# Altium schematic sheet Serial to USB Converter.SchDoc: UART0 Serial to USB Converter
size 393 x 281 mm; SheetNumber: 43; SheetTotal: 44
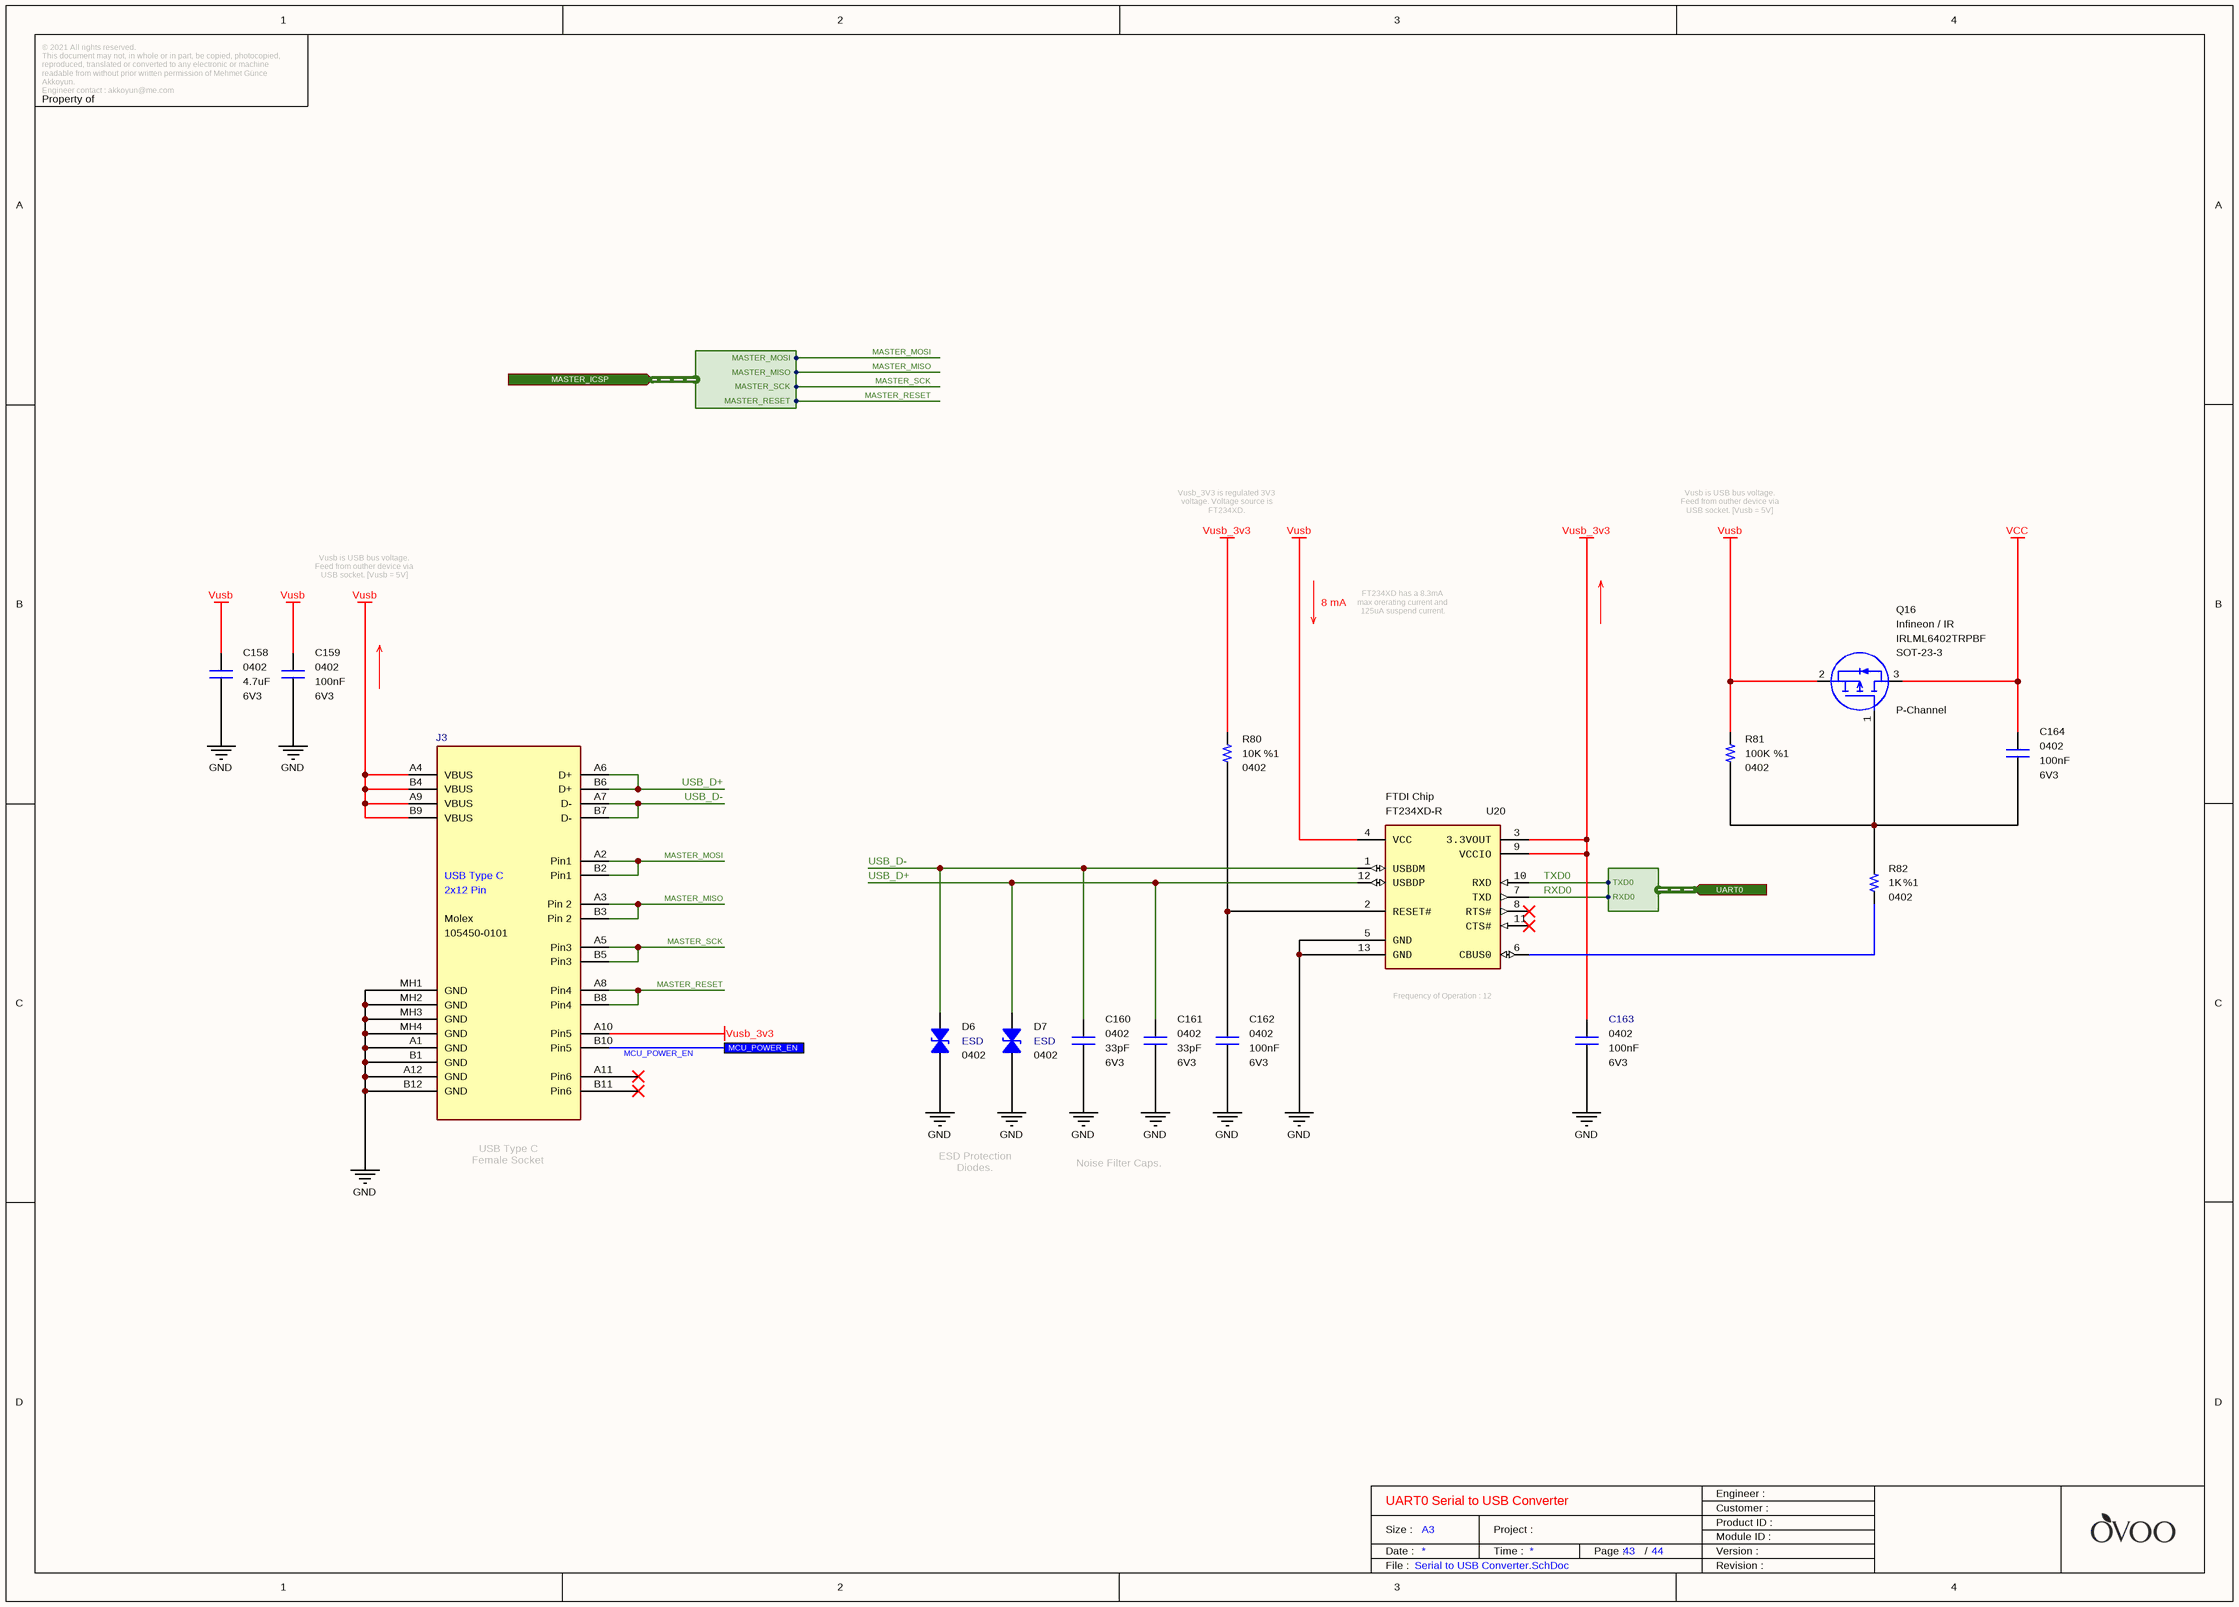
[diagram p0: Serial to USB Converter.SchDoc]

## Parts
C158  value 4.7uF  Case: 0402  Voltage: 6V3  [CAPACITOR_0402]  (hidden comment: Multilayer Ceramic Capacitor)
C159  value 100nF  Case: 0402  Voltage: 6V3  [CAPACITOR_0402]  (hidden comment: Multilayer Ceramic Capacitor)
C160  value 33pF  Case: 0402  Voltage: 6V3  [CAPACITOR_0402]  (hidden comment: Multilayer Ceramic Capacitor)
C161  value 33pF  Case: 0402  Voltage: 6V3  [CAPACITOR_0402]  (hidden comment: Multilayer Ceramic Capacitor)
C162  value 100nF  Case: 0402  Voltage: 6V3  [CAPACITOR_0402]  (hidden comment: Multilayer Ceramic Capacitor)
C163  value 100nF  Case: 0402  Voltage: 6V3  [CAPACITOR_0402]  (hidden comment: Multilayer Ceramic Capacitor)
C164  value 100nF  Case: 0402  Voltage: 6V3  [CAPACITOR_0402]  (hidden comment: Multilayer Ceramic Capacitor)
D6  Case: 0402  [ESD_0402]  (hidden comment: ESD Suppressors)
D7  Case: 0402  [ESD_0402]  (hidden comment: ESD Suppressors)
J3  Manufacturer Part Number: 105450-0101  Manufacturer Name: Molex  [USB Type C - Molex 105450-0101]  (hidden comment: USB Type C SMD Connector)
Q16  Transistor Polarity: P-Channel  Manufacturer Part Number: IRLML6402TRPBF  Manufacturer Name: Infineon / IR  [SOT-23-3]  (hidden comment: P-Channel MosFET)
R80  value 10K  Tolerance: %1  Case: 0402  [RESISTOR_0402]  (hidden comment: Thick Film Resistor)
R81  value 100K  Tolerance: %1  Case: 0402  [RESISTOR_0402]  (hidden comment: Thick Film Resistor)
R82  value 1K  Tolerance: %1  Case: 0402  [RESISTOR_0402]  (hidden comment: Thick Film Resistor)
U20  Manufacturer Part Number: FT234XD-R  Manufacturer Name: FTDI Chip  [DFN-12]  (hidden comment: USB/UART IC)

## Ports
MASTER_ICSP (in, harness MASTER_ICSP), MCU_POWER_EN, UART0 (in, harness UART0)

## Harnesses
UART0: RXD0, TXD0
MASTER_ICSP: MASTER_MOSI, MASTER_MISO, MASTER_SCK, MASTER_RESET

## Nets
GND: C158.1 C159.1 C160.2 C161.2 C162.2 C163.2 D6.1 D7.1 J3.A1(GND) J3.A12(GND) J3.B1(GND) J3.B12(GND) J3.MH1(GND) J3.MH2(GND) J3.MH3(GND) J3.MH4(GND) U20.5(GND) U20.13(GND)
VCC: C164.2 Q16.3(D)
Vusb: C158.2 C159.2 J3.A4(VBUS) J3.A9(VBUS) J3.B4(VBUS) J3.B9(VBUS) Q16.2(S) R81.2 U20.4(VCC)
Vusb_3v3: C163.1 J3.A10(Pin5) R80.2 U20.3(3.3VOUT) U20.9(VCCIO)
MASTER_MISO: J3.A3(Pin_2) J3.B3(Pin_2) ; port MASTER_ICSP.MASTER_MISO
MASTER_MOSI: J3.A2(Pin1) J3.B2(Pin1) ; port MASTER_ICSP.MASTER_MOSI
MASTER_RESET: J3.A8(Pin4) J3.B8(Pin4) ; port MASTER_ICSP.MASTER_RESET
MASTER_SCK: J3.A5(Pin3) J3.B5(Pin3) ; port MASTER_ICSP.MASTER_SCK
MCU_POWER_EN: J3.B10(Pin5) ; port MCU_POWER_EN
RXD0: U20.7(TXD) ; port UART0.RXD0
TXD0: U20.10(RXD) ; port UART0.TXD0
USB_D+: C161.1 D7.2 J3.A6(D+) J3.B6(D+) U20.12(USBDP)
USB_D-: C160.1 D6.2 J3.A7(D-) J3.B7(D-) U20.1(USBDM)
NetC162_1: C162.1 R80.1 U20.2(RESET#)
NetC164_1: C164.1 Q16.1(G) R81.1 R82.2
NetR82_1: R82.1 U20.6(CBUS0)

Not connected (* = marked no-connect by the designer): J3 A11(Pin6)* B11(Pin6)*; U20 8(RTS#)* 11(CTS#)*

## Notes on the sheet
- Vusb_3V3 is regulated 3V3 voltage. Voltage source is FT234XD.
- Vusb is USB bus voltage. Feed from outher device via USB socket. [Vusb = 5V]
- 8 mA
- FT234XD has a 8.3mA max orerating current and 125uA suspend current.
- (near U20) Frequency of Operation : 12 MHz
- (near J3) USB Type C
  Female Socket
- ESD Protection Diodes.
- Noise Filter Caps.
- © 2021 All rights reserved.
  This document may not, in whole or in part, be copied, photocopied, reproduced, translated or converted to any electronic or machine readable from without prior written permission of Mehmet Günce Akkoyun.
  Engineer contact : akkoyun@me.com
- Property of
- Engineer :
- Date :
- Size :
- A3
- Time :
- Project :
- Page :
- /
- Customer :
- Product ID :
- Module ID :
- Version :
- File :
- Revision :
- (in symbol Connector - USB Type C) USB Type C; 2x12 Pin
- (in symbol Diode - ESD Protection) ESD

## Library data of the parts
C158 = Capacitor - 4.7uF [0402-6V3]: Capacitor - 4.7uF [0402] (Ceramic); Manufacturer Name: Kemet; Manufacturer Part Number: C0402C475M9PACTU; Dielectric: X5R; Tolerance: %20; Height: 0.5mm; ComponentLink1Description: Mouser; ComponentLink1URL: https://www.mouser.com.tr/ProductDetail/KEMET/C0402C475M9PACTU?qs=x4XeXhDQKnr0GX0Xu9DUoQ==; ComponentLink2Description: DataSheet; ComponentLink2URL: https://www.mouser.com.tr/datasheet/2/40/cx5r-776519.pdf; ROHS: Yes; Maximum Operating Temperature: +85; Minimum Operating Temperature: -55; Supplier 1: Mouser; Supplier 2: Arrow; Supplier 3: Farnell; Supplier 4: Digi-Key; Supplier Part Number 1: 80-C0402C475M9P; Supplier Part Number 2: C0402C475M9PACTU; Supplier Part Number 3: 2750760; Supplier Part Number 4: 399-13068-1-ND; Mouser Part Number: 80-C0402C475M9P
C159 C162-C164 = Capacitor - 100nF [0402-6V3]: Capacitor - 100nF [0402-6V3] (Ceramic); Manufacturer Name: AVX; Manufacturer Part Number: 04026D104KAT4A; Dielectric: X5R; Tolerance: %10; Height: 0.25mm; ComponentLink1Description: Mouser; ComponentLink1URL: https://www.mouser.com.tr/ProductDetail/AVX/04026D104KAT4A?qs=sGAEpiMZZMs0AnBnWHyRQPg4iYkCw7IMED%2F4kpqgf7w%3D; ComponentLink2Description: DataSheet; ComponentLink2URL: https://www.mouser.com.tr/datasheet/2/40/cx5r-776519.pdf; ROHS: Yes; Maximum Operating Temperature: +85; Minimum Operating Temperature: -55; Supplier 1: Avnet; Supplier Part Number 1: 04026D104KAT4A; Mouser Part Number: 581-04026D104KAT4A
C160 C161 = Capacitor - 33pF [0402-6V3]: Capacitor - 33pF [0402] (Ceramic); Manufacturer Name: Kemet; Manufacturer Part Number: C0402C330J9RACAUTO; Dielectric: X7R; Tolerance: 10%; Height: 0.5mm; Maximum Operating Temperature: +125; Minimum Operating Temperature: -55; ROHS: Yes; ComponentLink1Description: DataSheet; ComponentLink1URL: https://api.kemet.com/component-edge/download/datasheet/C0402C330J9RACAUTO.pdf; ComponentLink2Description: Mouser; ComponentLink2URL: https://www.mouser.com/Search/Refine.aspx?Keyword=80-C0402C330J9RAUTO; Supplier 1: Mouser; Supplier Part Number 1: 80-C0402C330J9RAUTO; Mouser Part Number: 80-C0402C330J9RAUTO
D6 D7 = Diode - ESD Protection: TVS Diode (Bi-directional); Manufacturer Part Number: 0402ESDA-MLP1; Manufacturer Name: Bussmann / Eaton; Clamping Voltage: 35V; Diode Capacitance: 0.05pF; Polarity: Bidirectional; Voltage ESD Air Gap: 15kV; Voltage ESD Contact: 8kV; Working Voltage: 30V; Height: 0.436mm; Maximum Operating Temperature: +125; Minimum Operating Temperature: -55; ROHS: Yes; ComponentLink1Description: DataSheet; ComponentLink1URL: https://www.mouser.com.tr/datasheet/2/87/47c59e11-d058-4882-bc35-d8572f2ca054-38826.pdf; ComponentLink2Description: Mouser; ComponentLink2URL: https://www.mouser.com.tr/ProductDetail/Bussmann-Eaton/0402ESDA-MLP1?qs=%2Fha2pyFadughxyc7TyLWeW%2FUvipVY6Ex3naV%2FjpO3plZBZWDLqV4bw%3D%3D; Supplier 1: Mouser; Supplier 2: Digi-Key; Supplier Part Number 2: 283-2964-1-ND; Supplier Part Number 1: 504-0402ESDA-MLP1; Mouser Part Number: 504-0402ESDA-MLP1
J3 = Connector - USB Type C: USB Connectors USB Type C Recep R/A TOPMNT GLD Flash; Contact: 24; ROHS: Yes; ComponentLink1Description: DataSheet; ComponentLink1URL: https://www.mouser.com.tr/datasheet/2/276/1/1054500101_IO_CONNECTORS-1373915.pdf; ComponentLink2Description: Mouser; ComponentLink2URL: https://www.mouser.com.tr/ProductDetail/Molex/105450-0101?qs=%2Fha2pyFaduilhIhGrcOnZKIbgAc75siexx3a9CswCkZ6hpfCuwF0Ig%3D%3D; Case: SMD; ComponentLink3Description: Drawing; ComponentLink3URL: https://www.molex.com/pdm_docs/sd/1054500101_sd.pdf; ComponentLink4Description: Product Page; ComponentLink4URL: https://www.molex.com/molex/products/part-detail/io_connectors/1054500101; Supplier 1: Digi-Key; Supplier 2: Digi-Key; Supplier 3: Digi-Key; Supplier 4: Newark; Supplier 5: Newark; Supplier 6: Avnet; Supplier 7: Avnet; Supplier 8: RSComponents; Supplier 9: RSComponents; Supplier 10: Mouser; Supplier 11: Arrow Electronics; Supplier 12: Allied Electronics; Supplier 13: Farnell; Supplier Part Number 1: WM12856CT-ND; Supplier Part Number 2: WM12856DKR-ND; Supplier Part Number 3: WM12856TR-ND; Supplier Part Number 4: 33AC7773; Supplier Part Number 6: 33AC7773; Supplier Part Number 5: 02AH5567; Supplier Part Number 7: 02AH5567; Supplier Part Number 8: 9209199P; Supplier Part Number 9: 9209199; Supplier Part Number 10: 538-105450-0101; Supplier Part Number 11: 105450-0101; Supplier Part Number 12: 70799721; Supplier Part Number 13: 2524076
Q16 = Transistor - IRLML6402TRPBF: MOSFET MOSFT P-Ch -3.7A 65mOhm 8nC Log Lvl; Vds: 20 V; Id: 3.7 A; Vgs th: 4 V; Rds On: 65 mOhms; Vgs: 12 V; ComponentLink1Description: Mouser; ComponentLink1URL: https://www.mouser.com.tr/ProductDetail/Infineon-IR/IRLML6402TRPBF?qs=9%252BKlkBgLFf0HuZuONx2Ewg%3D%3D; ComponentLink2Description: DataSheet; ComponentLink2URL: https://www.mouser.com.tr/datasheet/2/196/irlml6402pbf-1732951.pdf; Maximum Operating Temperature: +150; Minimum Operating Temperature: -55; Supplier 1: Newark; Supplier 2: Avnet; Supplier 3: RSComponents; Supplier 4: Farnell; Supplier Part Number 1: 97K2355; Supplier Part Number 2: 97K2355; Supplier Part Number 3: 0301322; Supplier Part Number 4: 9103503; Case: SOT-23-3
R80 = Resistor - 10K: Thick Film Resistors - SMD 1/16 W 10 Kohms 1%; Manufacturer Name: Vishay; Manufacturer Part Number: CRCW040210K0FKED; Height: 0.4mm; ComponentLink1Description: DataSheet; ComponentLink1URL: https://www.mouser.com.tr/datasheet/2/427/dcrcwe3-1762152.pdf; ComponentLink2Description: Mouser; ComponentLink2URL: https://www.mouser.com.tr/ProductDetail/Vishay-Dale/CRCW040210K0FKED?qs=sGAEpiMZZMu61qfTUdNhG2DpbjADlD3GcalbOv9utCY%3D; Supplier 1: Mouser; Supplier 2: Digi-Key; Supplier Part Number 1: 71-CRCW040210K0FKEDH; Supplier Part Number 2: 541-10.0KYCT-ND; Mouser Part Number: 71-CRCW0402-10K-E3
R81 = Resistor - 100K: Thick Film Resistors - SMD 1/16 W 100 Kohms 1%; Manufacturer Name: Vishay; Manufacturer Part Number: CRCW0402100KFKED; Height: 0.35mm; Mouser Part Number: 71-CRCW0402-100K-E3; ComponentLink1Description: DataSheet; ComponentLink1URL: https://www.mouser.com.tr/datasheet/2/427/dcrcwe3-1762152.pdf; ComponentLink2Description: Mouser; ComponentLink2URL: https://eu.mouser.com/ProductDetail/Vishay-Dale/CRCW0402100KFKED?qs=OlqPY1CiralZGKRwQ4Glcg%3D%3D; Supplier 1: Future Electronics; Supplier 2: Future Electronics; Supplier 3: Arrow; Supplier 4: Farnell; Supplier 5: Digi-Key; Supplier Part Number 1: CRCW0402100KFKED-CUTT; Supplier Part Number 2: CRCW0402100KFKED-REEL; Supplier Part Number 3: CRCW0402100KFKED; Supplier Part Number 4: 2121857; Supplier Part Number 5: 541-100KLCT-ND
R82 = Resistor - 1K: Thick Film Resistors - SMD 1/16 W 1.0 Kohms 1%; Manufacturer Name: Vishay; Manufacturer Part Number: CRCW04021K00FKED; Height: 0.35mm; Mouser Part Number: 71-CRCW0402-1.0K-E3; ComponentLink1Description: DataSheet; ComponentLink1URL: https://www.mouser.com.tr/datasheet/2/427/dcrcwe3-1762152.pdf; ComponentLink2Description: Mouser; ComponentLink2URL: https://www.mouser.com.tr/ProductDetail/Vishay-Dale/CRCW04021K00FKED?qs=sGAEpiMZZMu61qfTUdNhG2DpbjADlD3GFJ4zSbeLqG8%3D; Supplier 1: Mouser; Supplier 2: Digi-Key; Supplier Part Number 1: 71-CRCW0402-1.0K-E3; Supplier Part Number 2: 541-1.00KLCT-ND
U20 = IC - FT234XD-R: Height: 0.75mm; Mouser Part Number: 895-FT234XD-R; ComponentLink1Description: DataSheet; ComponentLink1URL: https://componentsearchengine.com/Datasheets/2/FT234XD-R.pdf; ComponentLink2Description: Mouser; ComponentLink2URL: https://www.mouser.com/Search/Refine.aspx?Keyword=895-FT234XD-R; Supplier 1: Mouser; Supplier 2: Arrow; Supplier 3: Farnell; Supplier 4: Newark; Supplier 5: Digi-Key; Supplier Part Number 1: 895-FT234XD-R; Supplier Part Number 2: FT234XD-R; Supplier Part Number 3: 2419911; Supplier Part Number 4: 53X3171; Supplier Part Number 5: 768-1178-1-ND